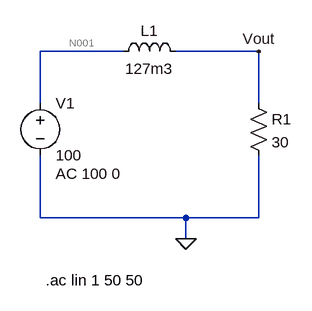
[diagram p0: schematic Experiment 6.asc]
Experiment 6.asc, the LTspice schematic file:
Version 4
SHEET 1 880 680
WIRE 144 48 16 48
WIRE 352 48 224 48
WIRE 16 128 16 48
WIRE 352 128 352 48
WIRE 16 304 16 208
WIRE 240 304 16 304
WIRE 352 304 352 208
WIRE 352 304 240 304
WIRE 240 336 240 304
FLAG 240 336 0
FLAG 352 48 Vout
SYMBOL voltage 16 112 R0
WINDOW 123 24 124 Left 2
WINDOW 39 0 0 Left 0
SYMATTR InstName V1
SYMATTR Value 100
SYMATTR Value2 AC 100 0
SYMBOL ind 128 64 R270
WINDOW 0 32 56 VTop 2
WINDOW 3 5 56 VBottom 2
SYMATTR InstName L1
SYMATTR Value 127m3
SYMBOL res 336 112 R0
SYMATTR InstName R1
SYMATTR Value 30
TEXT 24 400 Left 2 !.ac lin 1 50 50

The netlist it stands for:
* Experiment 6.asc
V1 N001 0 100 AC 100 0
L1 N001 Vout 127m3
R1 Vout 0 30
.ac lin 1 50 50
.backanno
.end

* Results of the author's LTspice run, read from the files saved beside the schematic
* AC Analysis:
*   frequency = 50 
*   V(n001) = 100 V
*   V(vout) = 36.01 V
*   I(L1) = 1.2 A
*   I(R1) = 1.2 A
*   I(V1) = -1.2 A